# EAGLE design WaterDetection (EAGLE 5.10)
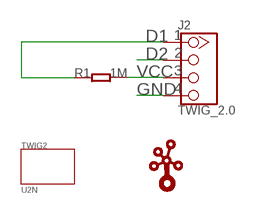
[diagram p0: schematic, sheet 1]

## Parts
J2  TWIG_2.0  [2.0_1X4]
R1  1M  R0603  [0603]
TWIG2  U2N  [U2N]
U$1  TWIGLOGOTWIGLOGO_SMALL  [TWIGLOGO_SMALL]

## Nets
D1: J2.1 R1.1
D2: J2.2
GND: J2.4
VCC: J2.3 R1.2

## Library data of the parts
J2 = CONNECTER:TWIG_2.0
R1 = CPT_SMD:R0603
TWIG2 = twig_template1:U2N
U$1 = seeedleo:TWIGLOGO

## Board
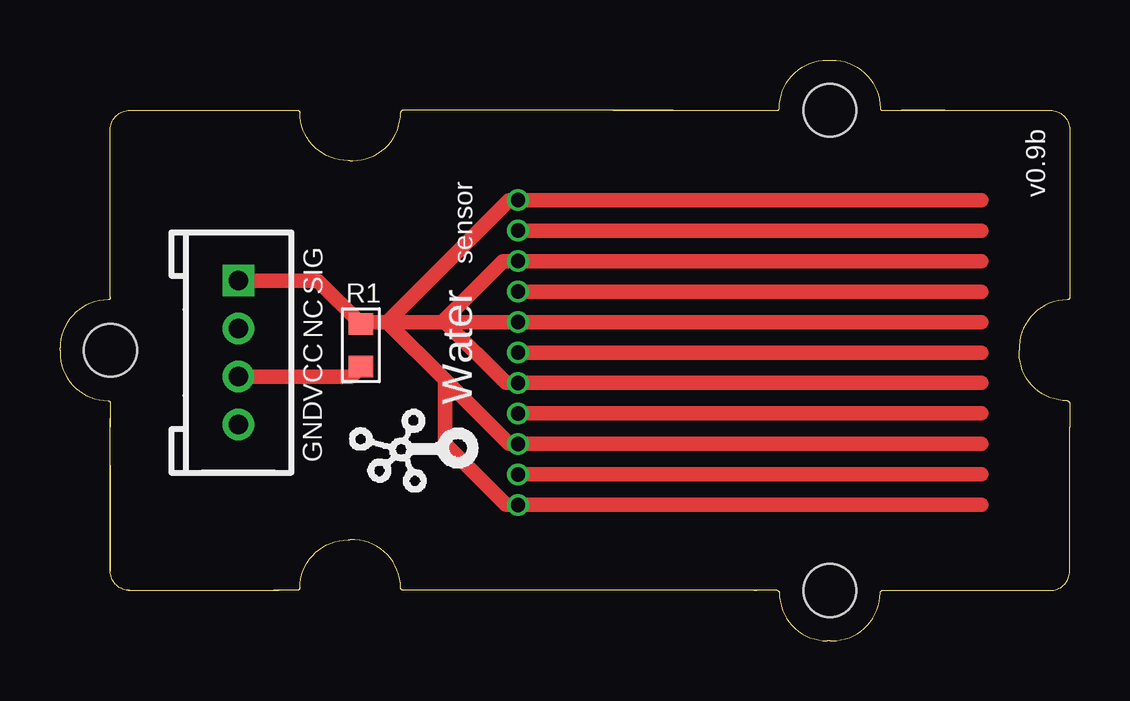
[diagram p1: board, top side]
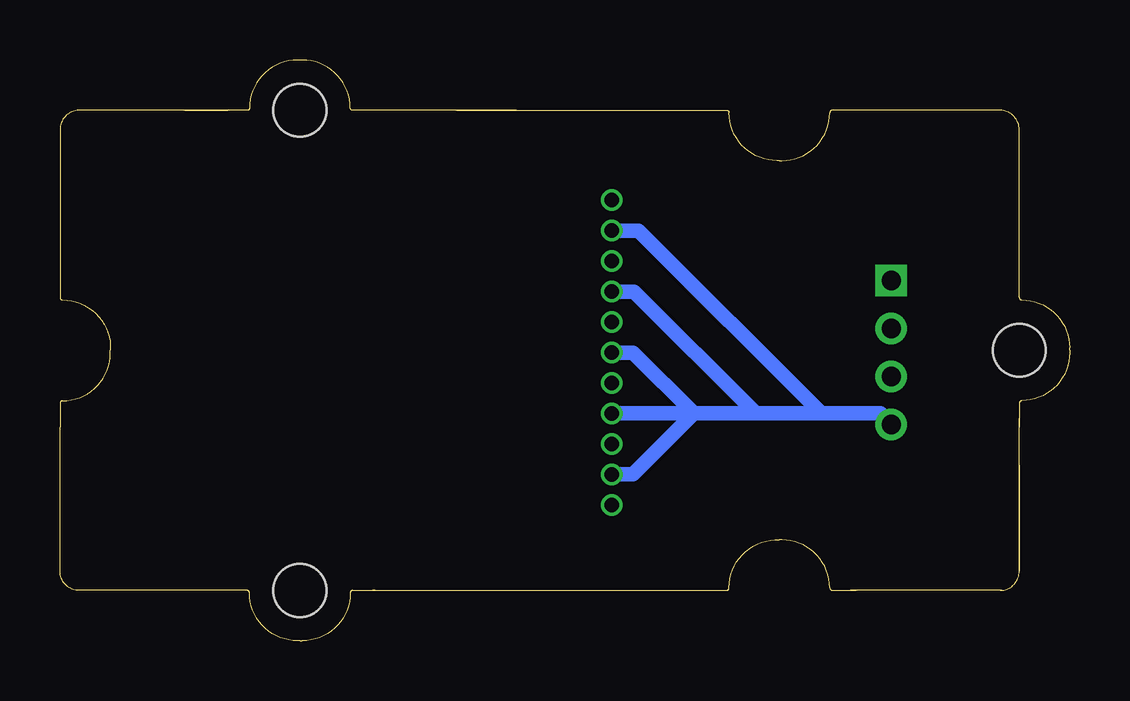
[diagram p2: board, bottom side, seen from below]

Size 42.09 x 24.2 mm. Coordinates in mm from the lower left corner, seen from the top.
Copper layers (1*16): Top 0.035mm / dielectric 1.5mm / Bottom 0.035mm
Design rules "SeeedStudio_rule_no_angle_090911": minimum track width 6mil, minimum drill 12mil, track to track 6mil, track to pad 6mil, pad to pad 6mil, via to via 6mil, smd to smd 0mil, copper to edge 10mil, drill to drill 10mil, minimum pad ring 10mil, minimum via ring 6mil, stop-mask expansion 2mil, vias tented up to drill 100mil, thermal gap 10mil

### Footprints (pad centres in the part's own frame; a part is rotated, then mirrored left to right if it is on the bottom)
2.0_1X4 = drill 0.8 pad 1.27 square: 1 -3,0 | drill 0.8 pad 1.27 round: 2 -1,0; 3 1,0; 4 3,0
0603 = smd 0.889 x 1.016: 1 -0.889,0; 2 0.889,0
U2N = hole 2.2: 10.453,-10.42; 10.453,9.58; -19.535,-0.415

### Placement (x,y rotation side)
J2  7.44,12.01 270 top
R1  12.54,12.32 270 top
TWIG2  21.64,12.52 0 top
U$1  17.57,5.79 90 top

### Tracks (layer width: path | path; a pad name or v marks a point on that pad's centre or on a via)
D1  (via drill 0.6)
  Top 0.61: 38.4,13.28 v19.09,13.28 16.05,13.28 | 38.4,15.82 v19.09,15.82 18.46,15.82 15.92,13.28 | 38.4,10.74 v19.09,10.74 18.59,10.74 16.05,13.28 | 38.4,5.66 v19.09,5.66 18.59,5.66 16.05,8.2 16.05,10.87 | 38.4,18.36 v19.09,18.36 18.71,18.36 13.63,13.28 | 38.4,8.2 v19.09,8.2 18.71,8.2 16.05,10.87 | 15.92,13.28 16.05,13.28 | 15.92,13.28 13.63,13.28 | 13.63,13.28 13,13.28 R1.1 10.74,15.01 J2.1 | 13.63,13.28 16.05,10.87
GND  (via drill 0.6)
  Top 0.61: v19.09,6.93 38.4,6.93 | 38.4,14.55 v19.09,14.55 | v19.09,12.01 38.4,12.01 | v19.09,9.47 38.4,9.47 | v19.09,17.09 38.4,17.09
  Bottom 0.61: 15.67,9.47 v19.09,9.47 | 13.08,9.47 15.67,9.47 | v19.09,12.01 18.21,12.01 15.67,9.47 | v19.09,6.93 18.21,6.93 15.67,9.47 | v19.09,14.55 18.16,14.55 13.08,9.47 | 13.08,9.47 10.36,9.47 | v19.09,17.09 17.98,17.09 10.36,9.47 | 10.36,9.47 7.9,9.47 J2.4
VCC
  Top 0.61: J2.3 12.13,11.01 R1.2

### Text on the board
tPlace: v0.9b | SIG | sensor | NC | VCC | Water | GND